# EasyEDA Pro project 2025_10_02_esp32.epro

# Board PCB1
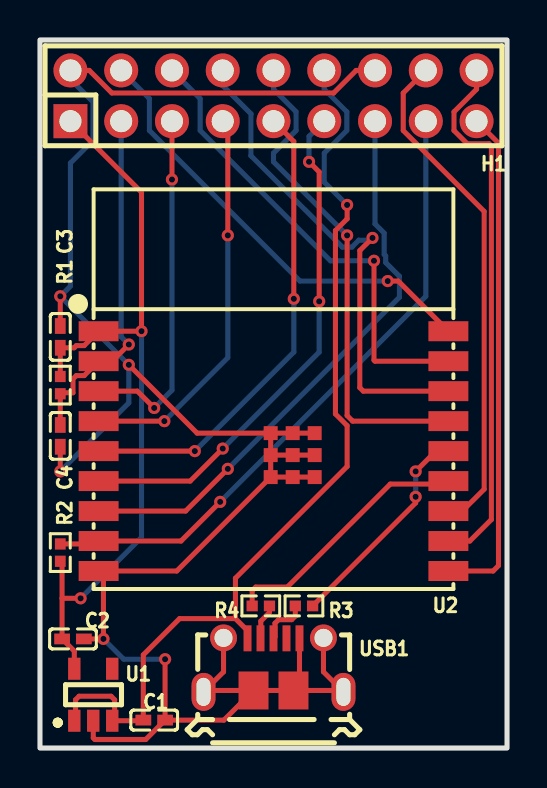
[diagram p0: board, top side]
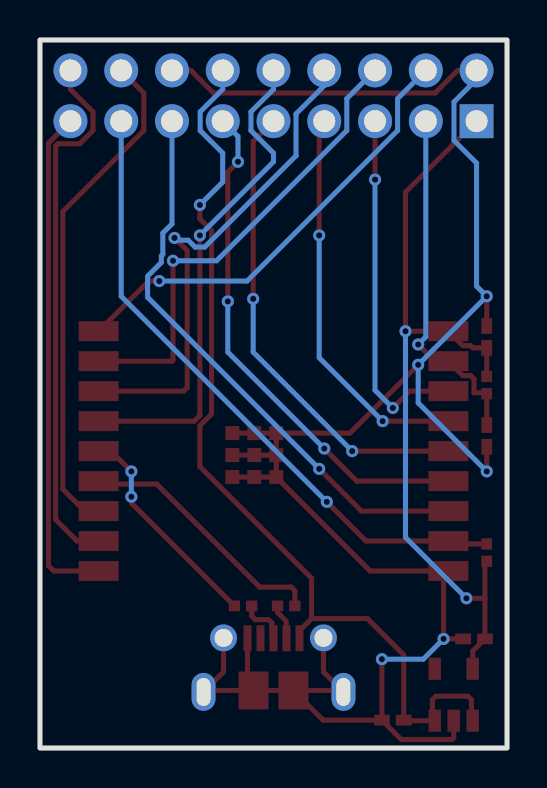
[diagram p1: board, bottom side, seen from below]

Outline 23.37 x 35.43 mm; copper layers: Top Layer, Bottom Layer. Coordinates in mm from the lower left corner of the outline.
Outline path: rectangle 0,35.43 23.37,0
Stack: Top Layer 0.035mm / Dielectric1 1.51mm FR4 er 4.5 / Bottom Layer 0.035mm

## Design rules (mm)
template: JLCPCB Capability(Two Layers Board)
spacing copperThickness1oz (default): track to track 0.102, other pairs 0.152 to 0.3
spacing copperThickness2oz: track to track 0.203, other pairs 0.152 to 0.3
track width copperThickness1oz (default): min 0.127, default 0.254, max 2.54
track width copperThickness2oz: min 0.203, default 0.254, max 2.54
differential pair differentialPair (default): width min 0.127, default 0.254, max 2.54; gap min 0.152, default 0.152
via viaSize (default): diameter min 0.5, default 0.61, max 10; hole min 0.3, default 0.305, max 6.3

## Placement (name value [footprint] x y rotation side)
C1  10uF  [C0402]  5.72 1.4 180 top
C2  10uF  [C0402]  1.65 5.46 180 top
C3  100nF  [C0402]  1.02 20.57 270 top
C4  100nF  [C0402]  1.02 15.62 90 top
H1  PZ254-2-09-Z-8.5  [HDR-TH_18P-P2.54-V-M-R2-C9-S2.54]  11.68 32.64 0 top
R1  10kΩ  [R0402]  1.02 18.16 90 top
R2  10kΩ  [R0402]  1.02 9.78 270 top
R3  22Ω  [R0402]  13.21 7.11 180 top
R4  22Ω  [R0402]  11.05 7.11 0 top
U1  AP2112K-3.3TRG1  [SOT-25-5_L2.9-W1.6-P0.95-LS2.8-BL]  2.67 2.67 0 top
U2  ESPRESSIF ESP32-C3-WROOM-02-N4  [BULETM-SMD_ESPRESSIF_ESP32-C3-WROOM-02-N4-4MB]  11.68 14.86 0 top
USB1  1050170001  [MICRO-USB-SMD_105017-0001]  11.68 4.16 0 top

## Footprints (pads in the part's own frame, mm; a bottom-side part is the same pattern mirrored in y, then rotated)
BULETM-SMD_ESPRESSIF_ESP32-C3-WROOM-02-N4-4MB
  rect 2x1 smd: 1(-8.75,6) 2(-8.75,4.5) 3(-8.75,3) 4(-8.75,1.5) 5(-8.75,0) 6(-8.75,-1.5) 7(-8.75,-3) 8(-8.75,-4.5) 9(-8.75,-6) 10(8.75,-6) 11(8.75,-4.5) 12(8.75,-3) 13(8.75,-1.5) 14(8.75,0) 15(8.75,1.5) 16(8.75,3) 17(8.75,4.5) 18(8.75,6)
  rect 0.7x0.7 smd: 19(-0.14,0.9) 19(-0.14,-0.2) 19(-0.14,-1.3) 19(0.96,0.9) 19(0.96,-0.2) 19(0.96,-1.3) 19(2.06,0.9) 19(2.06,-0.2) 19(2.06,-1.3)
C0402
  rect 0.79x0.54 smd: 1(-0.545,0) 2(0.545,0)
HDR-TH_18P-P2.54-V-M-R2-C9-S2.54
  rect 1.7x1.7 hole 1.1: 1(-10.16,-1.27)
  round 1.7 hole 1.1: 2(-10.16,1.27) 3(-7.62,-1.27) 4(-7.62,1.27) 5(-5.08,-1.27) 6(-5.08,1.27) 7(-2.54,-1.27) 8(-2.54,1.27) 9(0,-1.27) 10(0,1.27) 11(2.54,-1.27) 12(2.54,1.27) 13(5.08,-1.27) 14(5.08,1.27) 15(7.62,-1.27) 16(7.62,1.27) 17(10.16,-1.27) 18(10.16,1.27)
MICRO-USB-SMD_105017-0001
  rect 0.4x1.3 smd: 1(-1.3,1.33) 2(-0.65,1.33) 3(0,1.33) 4(0.65,1.33) 5(1.3,1.33)
  round 1.35 hole 0.9: 6(-2.5,1.35) 7(2.5,1.35)
  oval 1.2x1.9 hole 0.7x1.4: 8(3.5,-1.35) 9(-3.5,-1.35)
  rect 1.5x1.9 smd: 10(-1,-1.28) 10(1,-1.28)
R0402
  rect 0.566x0.54 smd: 1(-0.433,0) 2(0.433,0)
SOT-25-5_L2.9-W1.6-P0.95-LS2.8-BL
  rect 0.623x1.105 smd: 1(-0.95,-1.3) 2(-0.001,-1.3) 3(0.95,-1.3) 4(0.95,1.3) 5(-0.95,1.3)

## Nets
3V3: C2.2 C3.2 H1.1 R1.2 R2.2 U1.5 U2.1
+5V: C1.2 H1.12 U1.1 U1.3 USB1.1
GND: C1.1 C2.1 C3.1 C4.1 H1.2 H1.14 U1.2 U2.9 U2.19 USB1.5 USB1.6 USB1.7 USB1.8 USB1.9 USB1.10
DN: R4.2 USB1.2
DP: R3.2 USB1.3
EN: C4.2 H1.3 R1.1 U2.2
IO0: H1.4 U2.18
IO1: H1.6 U2.17
IO2: H1.8 U2.16
IO3: H1.10 U2.15
IO4: H1.5 U2.3
IO5: H1.7 U2.4
IO6: H1.9 U2.5
IO7: H1.11 U2.6
IO8: H1.13 U2.7
IO9: H1.15 R2.1 U2.8
IO10: H1.17 U2.10
IO18: R4.1 U2.13
IO19: R3.1 U2.14
RXD: H1.18 U2.11
TXD: H1.16 U2.12

Pads without a net: U1 4; USB1 4

## Via types
v1: diameter 0.61, hole 0.305, Top Layer to Bottom Layer, 26 vias

## Routing (per net, layer and track width the routed paths; a pad name or vN(x,y) marks a point on that pad's centre or on a via; arc(x,y) is an arc through that point)
3V3: length 39
  Top Layer w0.254: R2.2 1.11,9.26 1.11,7.49 ; R1.2 C3.2 1.71,20.03 1.82,20.14 2.21,20.14 U2.1 v1(5.08,20.86) 5.08,27.81 H1.1 ; 1.11,7.49 C2.2 1.72,4.85 U1.5 ; 1.11,7.49 v1(2.03,7.49)
  Bottom Layer w0.254: v1(5.08,20.86) 5.08,10.54 v1(2.03,7.49)
+5V: length 47.3
  Top Layer w0.254: v1(15.37,27.18) 15.37,26.48 14.78,25.9 14.78,16.72 15.37,16.13 15.37,14.09 9.78,8.5 9.78,6.48 ; 9.78,6.48 6.99,6.48 5.17,4.66 C1.2 5.14,1.37 U1.3 3.74,1.49 3.74,2.41 3.56,2.59 1.96,2.59 1.78,2.41 1.78,1.43 U1.1 ; 9.78,6.48 10.38,5.87 USB1.1
  Bottom Layer w0.254: H1.12 14.22,32.97 15.35,31.84 15.35,30.9 14.22,29.77 14.22,28.32 v1(15.37,27.18)
GND: length 107.6
  Top Layer w0.254: USB1.10 9.2,1.4 C1.1 ; USB1.10 8.25,2.88 ; USB1.10 USB1.10 ; USB1.5 12.98,3.18 USB1.10 ; U2.19 U2.19 U2.19 ; U2.19 U2.19 ; U2.19 U2.19 ; U2.19 U2.19 U2.19 ; U2.19 6.84,8.86 U2.9 3.18,8.62 v1(3.18,5.46) C2.1 ; U2.19 U2.19 U2.19 ; U2.19 7.86,15.76 v1(4.44,19.18) ; C4.1 v1(1.02,13.84) ; C1.1 v1(6.26,4.45) ; C1.1 5.29,0.43 2.75,0.43 2.67,0.51 2.67,1.37 ; 8.25,2.88 9.18,3.81 USB1.6 ; 8.25,2.88 USB1.9 ; 15.11,2.88 14.18,3.81 USB1.7 ; 15.11,2.88 USB1.10 ; 15.11,2.88 USB1.8 ; C3.1 v1(1.02,22.61) ; H1.14 15.82,33.91 14.69,32.78 3.6,32.78 2.47,33.91 H1.2
  Bottom Layer w0.254: v1(6.26,4.45) 4.19,4.45 v1(3.18,5.46) ; v1(1.02,13.84) 4.44,17.27 v1(4.44,19.18) v1(1.02,22.61) 1.52,23.11 1.52,29.27 2.65,30.4 2.65,32.33 1.52,33.46 H1.2
DN: length 1.8
  Top Layer w0.254: R4.2 11.48,6.78 11.05,6.35 11.05,5.51 USB1.2
DP: length 2.5
  Top Layer w0.254: R3.2 12.78,6.6 12.6,6.42 11.94,6.42 11.76,6.25 11.76,5.57 USB1.3
EN: length 17.8
  Top Layer w0.254: C4.2 1.02,17.73 1.07,17.78 1.65,17.78 1.65,18.47 1.82,18.64 2.21,18.64 U2.2 3.61,19.36 v1(4.44,20.19)
  Bottom Layer w0.254: v1(4.44,20.19) 4.06,20.57 H1.3
IO0: length 22.7
  Top Layer w0.254: U2.18 17.93,23.37 v1(17.4,23.37)
  Bottom Layer w0.254: v1(17.4,23.37) 13.01,23.37 5.47,30.9 5.47,32.5 H1.4
IO1: length 23.7
  Top Layer w0.254: v1(16.71,24.38) 16.71,19.41 16.76,19.36 U2.17
  Bottom Layer w0.254: v1(16.71,24.38) 14.53,24.38 8.01,30.9 8.01,32.5 H1.6
IO2: length 25.3
  Top Layer w0.254: U2.16 16.18,17.86 16,18.03 16,24.89 v1(16.64,25.53)
  Bottom Layer w0.254: v1(16.64,25.53) 16.52,25.41 15.95,25.41 15.61,25.07 15.12,25.07 10.56,29.64 10.56,31.74 9.14,33.15 H1.8
IO3: length 24.9
  Top Layer w0.254: v1(15.37,25.65) 15.37,16.64 15.65,16.36 U2.15
  Bottom Layer w0.254: v1(15.37,25.65) 11.68,29.34 11.68,29.77 12.81,30.9 12.81,31.84 11.68,32.97 H1.10
IO4: length 17.8
  Top Layer w0.254: v1(5.72,17.02) 4.87,17.86 U2.3 ; v1(6.6,28.45) H1.5
  Bottom Layer w0.254: v1(5.72,17.02) 6.6,17.91 v1(6.6,28.45)
IO5: length 19.7
  Top Layer w0.254: H1.7 9.4,31.12 v1(9.4,25.65) ; U2.4 v1(6.22,16.36)
  Bottom Layer w0.254: v1(6.22,16.36) 9.4,19.53 v1(9.4,25.65)
IO6: length 23.8
  Top Layer w0.254: U2.5 v1(7.75,14.86) ; v1(12.7,22.48) 12.7,30.35 H1.9
  Bottom Layer w0.254: v1(12.7,22.48) 12.7,19.81 v1(7.75,14.86)
IO7: length 25.8
  Top Layer w0.254: U2.6 7.52,13.36 v1(9.14,14.99) ; v1(13.97,22.35) 13.97,28.83 v1(13.46,29.34)
  Bottom Layer w0.254: v1(13.46,29.34) 13.46,30.61 H1.11 ; v1(13.97,22.35) 13.97,19.81 v1(9.14,14.99)
IO8: length 28.8
  Top Layer w0.254: v1(9.4,13.97) 7.29,11.86 U2.7
  Bottom Layer w0.254: v1(9.4,13.97) 17.98,22.56 17.98,23.61 17.3,24.3 17.3,24.63 17.22,24.7 17.22,25.77 16.76,26.23 H1.13
IO9: length 32.2
  Top Layer w0.254: v1(9.02,12.32) 7.06,10.36 U2.8 2.79,10.21 R2.1
  Bottom Layer w0.254: v1(9.02,12.32) 19.3,22.61 H1.15
IO10: length 25.3
  Top Layer w0.254: U2.10 22.67,8.86 22.94,9.13 22.94,30.27 H1.17
IO18: length 12.9
  Top Layer w0.254: U2.13 20.28,13.21 17.53,13.21 12.37,8.05 10.8,8.05 10.62,7.87 R4.1
IO19: length 10.9
  Top Layer w0.254: v1(18.8,12.57) 18.8,12.27 R3.1 ; v1(18.8,13.84) 19.81,14.86 U2.14
  Bottom Layer w0.254: v1(18.8,12.57) v1(18.8,13.84)
RXD: length 27
  Top Layer w0.254: U2.11 21.51,10.36 22.59,11.43 22.59,30.12 22.47,30.24 21.38,30.24 20.72,30.9 20.72,31.84 21.84,32.97 H1.18
TXD: length 25.3
  Top Layer w0.254: U2.12 21.13,11.86 22.22,12.95 22.22,26.85 18.18,30.9 18.18,32.78 H1.16
